# Altium schematic sheet aaa_Empty_Mechanical_Parts.SchDoc: Mechanical Parts
size A3; Date: not used; ApprovedBy: not used; CheckedBy: not used; Author: not used; CompanyName: not used; DrawnBy: Drawn by; Engineer: not used; Organization: SMS-Lab; Address1: not used; Address2: not used; Address3: not used; Address4: not used; DocumentNumber: SMS-yyyy.m; Revision: 0; Time: not used; ModifiedDate: not used; ImagePath: not used
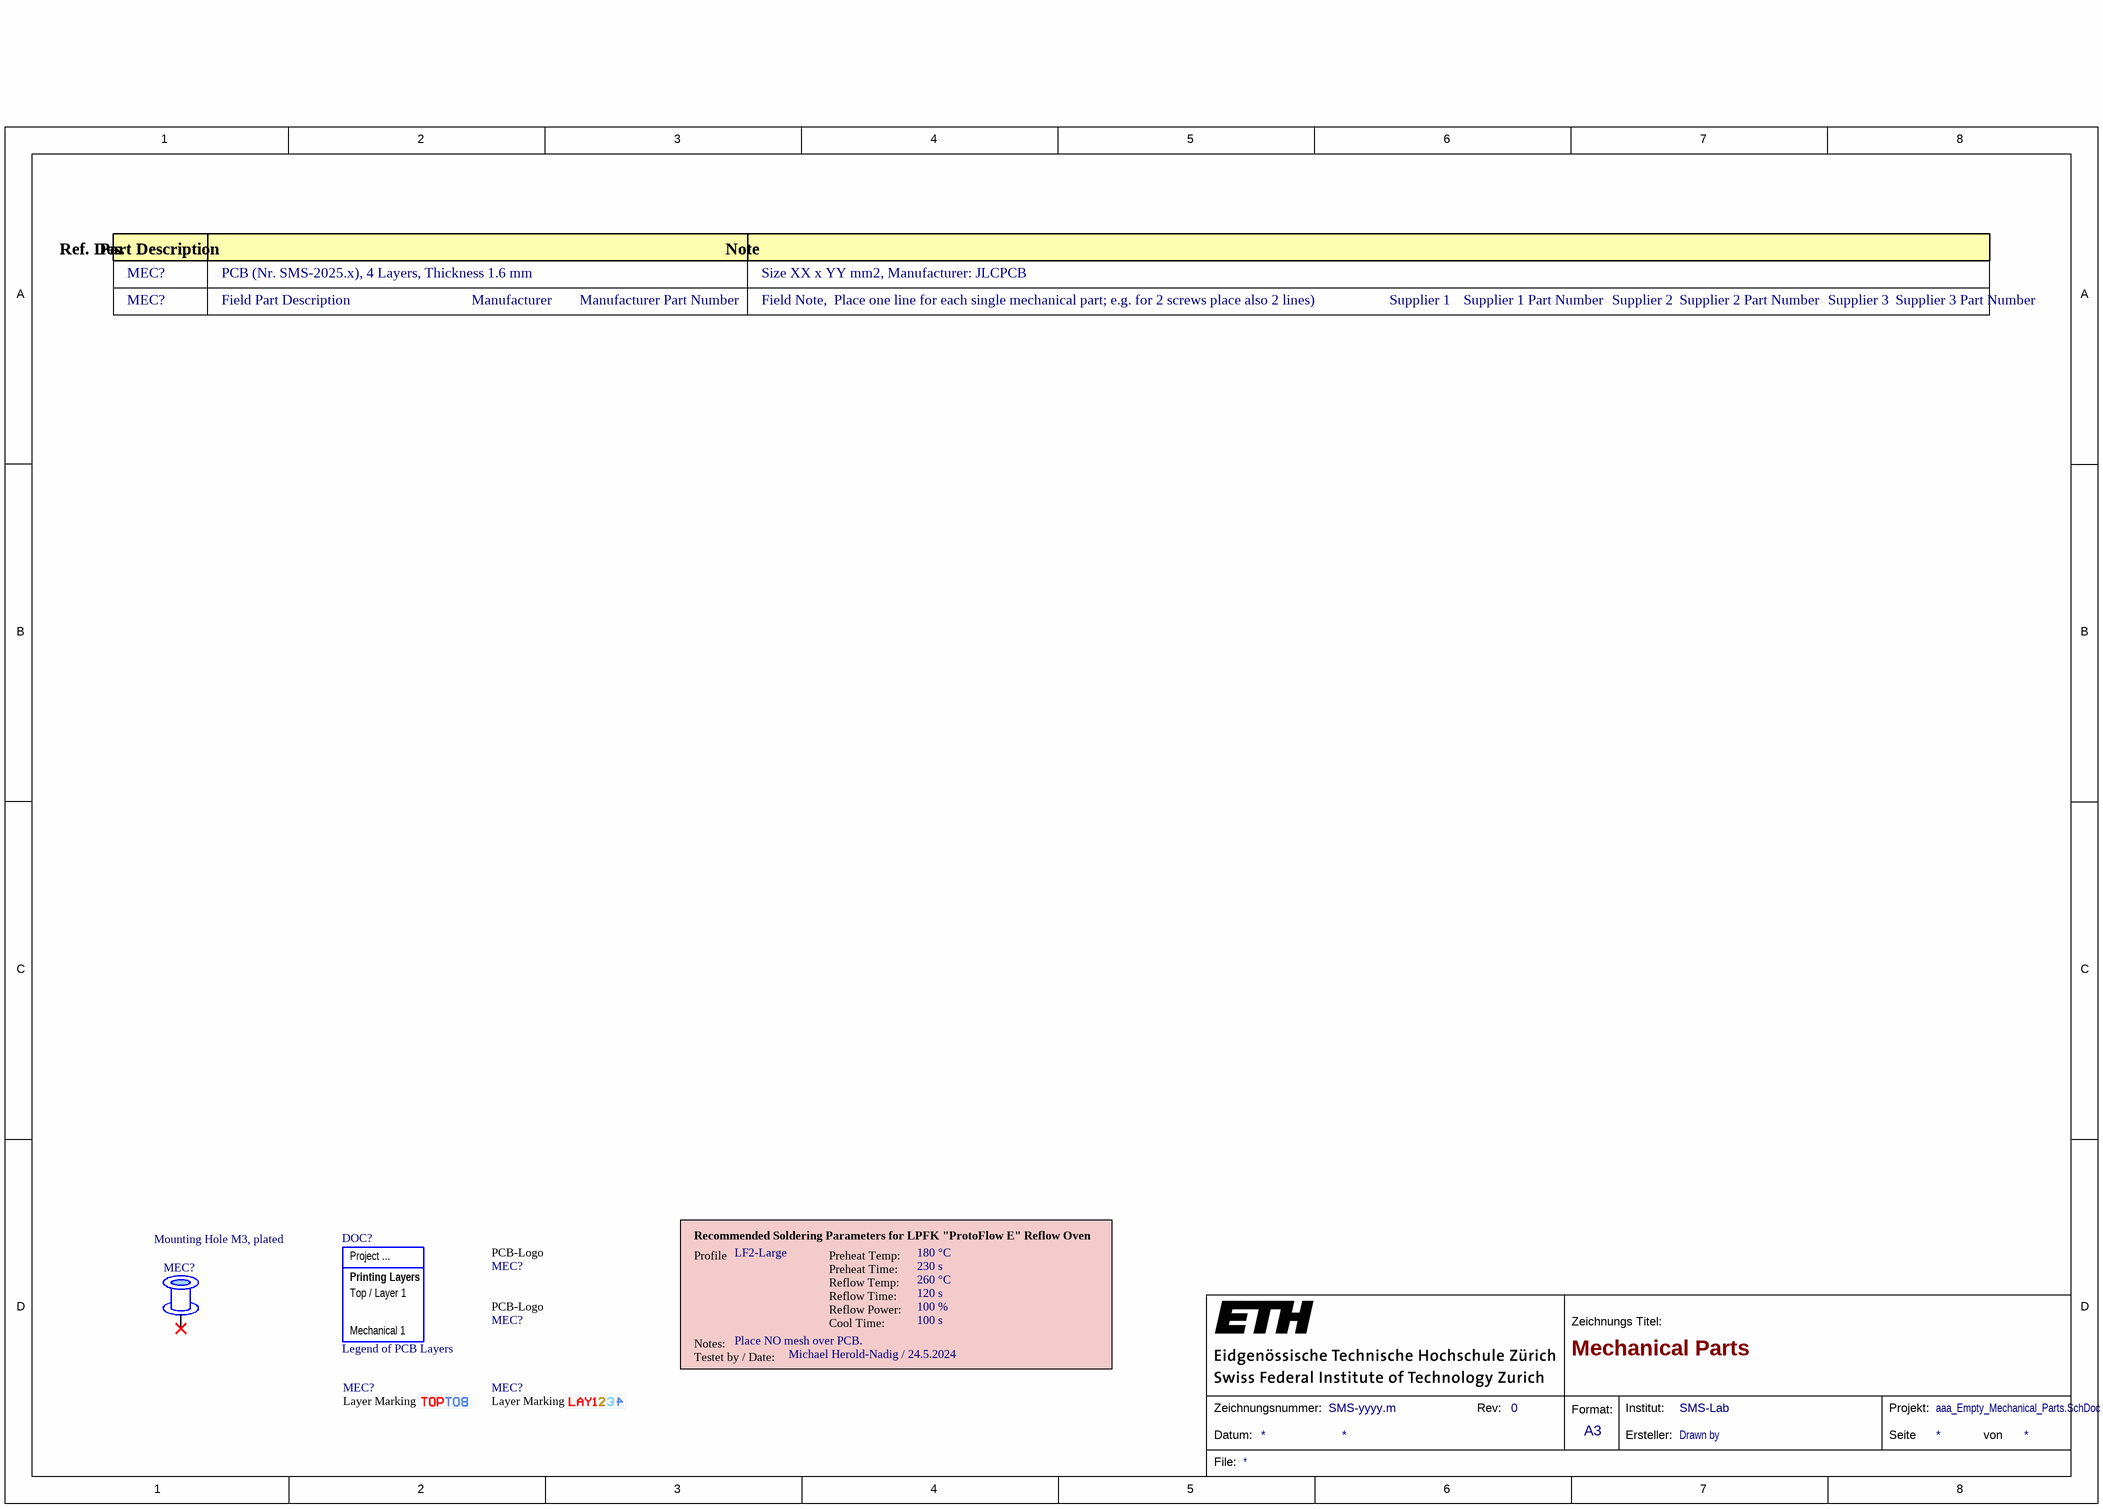
[diagram p0: aaa_Empty_Mechanical_Parts.SchDoc]

## Parts
(Parts that share a designator on the sheet are numbered #1, #2 ... from top to bottom, then left to right.)
DOC?  Legend of PCB Layers  [Legend of Visable Layers for PCB Output Files (up to 4 Layer PCBs)]  (no BOM)
MEC?#1  Note: Size XX x YY mm2, Manufacturer: JLCPCB  [DUMMY_EMPTY_FOOTPRINT]  (hidden comment: PCB (Nr. SMS-2025.x), 4 Layers, Thickness 1.6 mm)  (mechanical)
MEC?#2  Note: Field Note,  Place one line for each single mechanical part; e.g. for 2 screws place also 2 lines)  [DUMMY_EMPTY_FOOTPRINT]  (hidden comment: Field Part Description)  (mechanical)
MEC?#3  Logo ETH for PCB  [LOGO_ETH 5.3 x 2mm2_Silk]  (value not drawn)  (no BOM)
MEC?#4  Mounting Hole M3, plated  [Mounting Hole M3, plated]  (no BOM)
MEC?#5  Logo ETH zürich for PCB  [LOGO_ETH_zürich 12.4 x 2mm2_Silk]  (value not drawn)  (no BOM)
MEC?#6  For 2 Layer PCBs or Multilayer for Information  [LAYER_Label_TOP_BOT_Solder]  (value not drawn)  (no BOM)
MEC?#7  For 4 Layer PCBs  [LAYER_Label_LAY1234]  (value not drawn)  (no BOM)
MECH_HEADER  Mechanical Part Header  [DUMMY_EMPTY_FOOTPRINT]  (value not drawn)  (graphical)
SOLDERING_PARAMETERS  Tested by & Date: Michael Herold-Nadig / 24.5.2024  Soldering Notes: Place NO mesh over PCB.  Profile Name: LF2-Large  Cool Time: 100 s  Reflow Power: 100 %  Reflow Time: 120 s  Preheat Time: 230 s  Reflow Temperature: 260 °C  Preheat Temperature: 180 °C  (hidden comment: Soldering Parameters_LPFK ProtoFlow E)  (graphical)

## Nets

Not connected (* = marked no-connect by the designer): MEC?#4 1*

## Notes on the sheet
- 1
- 2
- 3
- 4
- 5
- 6
- 7
- 8
- A
- B
- C
- D
- Zeichnungs Titel:
- Datum:
- Zeichnungsnummer:
- Rev:
- Format:
- A3
- Ersteller:
- Institut:
- Seite
- Projekt:
- von
- File:
- (in symbol Legend of Visable Layers for PCB Output Files (up to 4 Layer PCBs)) Project ...; Printing Layers; Top / Layer 1; Mechanical 1
- (in symbol Logo ETH) PCB-Logo
- (in symbol Logo ETH zürich) PCB-Logo
- (in symbol Mechanical Part Header) Ref. Des.; Part Description; Note
- (in symbol PCB Layer Marking LAY1234) Layer Marking
- (in symbol PCB Layer Marking TOP/BOT) Layer Marking
- (in symbol Soldering Parameters_LPFK ProtoFlow E) Recommended Soldering Parameters for LPFK "ProtoFlow E" Reflow Oven; Profile; Preheat Temp:; Preheat Time:; Reflow Temp:; Reflow Time:; Reflow Power:; Cool Time:; Notes:; Testet by / Date:

## Library data of the parts
DOC? = Legend of Visable Layers for PCB Output Files (up to 4 Layer PCBs): To show in a table, beside the designed Printed Circuit Board, all visable PCB layers at the generated PDF and Gerber/ODB++ Outputs for Documentation. With this Legend one can see clearly which Layers are actually shown at a certain plot.; Latest Revision Made By: Michael Herold-Nadig; Latest Revision Note: New Part; Latest Revision Date: 8.6.2019; ComponentLink1Description: Show Datasheet on SMS Drive; ComponentLink1URL: P:\Electronic Workshop\Datasheets (Refered in Libraries - Don't Change!)\
MEC?#1 MEC?#2 = Mechanical Part: Mechanical Part for BOM; Latest Revision Made By: Michael Herold-Nadig; Latest Revision Note: y-Axis shiftet by +10 mil to set Text in MEC-Part-Colums on 50 mil-Grid; Latest Revision Date: 26.6.2019; ComponentLink1Description: Show Datasheet on SMS Drive; ComponentLink1URL: P:\Electronic Workshop\Datasheets (Refered in Libraries - Don't Change!)\; Supplier 3: Supplier 3; Supplier 1: Supplier 1; Supplier 2: Supplier 2; Manufacturer: Manufacturer
  MEC?#1: Value: PCB (Nr. SMS-2025.x), 4 Layers, Thickness 1.6 mm
  MEC?#2: Supplier 3 Part Number: Supplier 3 Part Number; Supplier 1 Part Number: Supplier 1 Part Number; Supplier 2 Part Number: Supplier 2 Part Number; Manufacturer Part Number: Manufacturer Part Number; Value: Field Part Description
MEC?#3 = Logo ETH: GRAPH ETH, different Sizes
MEC?#4 = Mounting Hole M3, plated: Mounting Hole for M3 Screw, plated to connect signal; Latest Revision Made By: Jonas Giné; Latest Revision Note: New Parameters Added; Latest Revision Date: 25.11.13; ComponentLink1Description: Show Datasheet on SMS Drive; ComponentLink1URL: P:\Electronic Workshop\Datasheets (Refered in Libraries - Don't Change!)\
MEC?#5 = Logo ETH zürich: GRAPH ETH zürich, different Sizes
MEC?#6 = PCB Layer Marking TOP/BOT
MEC?#7 = PCB Layer Marking LAY1234
MECH_HEADER = Mechanical Part Header: Header for Mechanical Part List; Latest Revision Made By: Michael Herold-Nadig; Latest Revision Note: y-Axis shiftet by +10 mil to set Text in MEC-Part-Colums on 50 mil-Grid; Latest Revision Date: 26.6.2019; ComponentLink1Description: Show Datasheet on SMS Drive; ComponentLink1URL: P:\Electronic Workshop\Datasheets (Refered in Libraries - Don't Change!)\
SOLDERING_PARAMETERS = Soldering Parameters_LPFK ProtoFlow E: Recomended Soldering Parameters for Schematic's Mechanical Page; Latest Revision Made By: Michael Herold-Nadig; Latest Revision Note: New Part; Latest Revision Date: 24.5.2024; ComponentLink1Description: Show Datasheet on SMS Drive; ComponentLink1URL: P:\Electronic Workshop\Datasheets (Refered in Libraries - Don't Change!)\